# Altium schematic sheet Power.SchDoc
size 292 x 193 mm; SheetNumber: 2; SheetTotal: 3
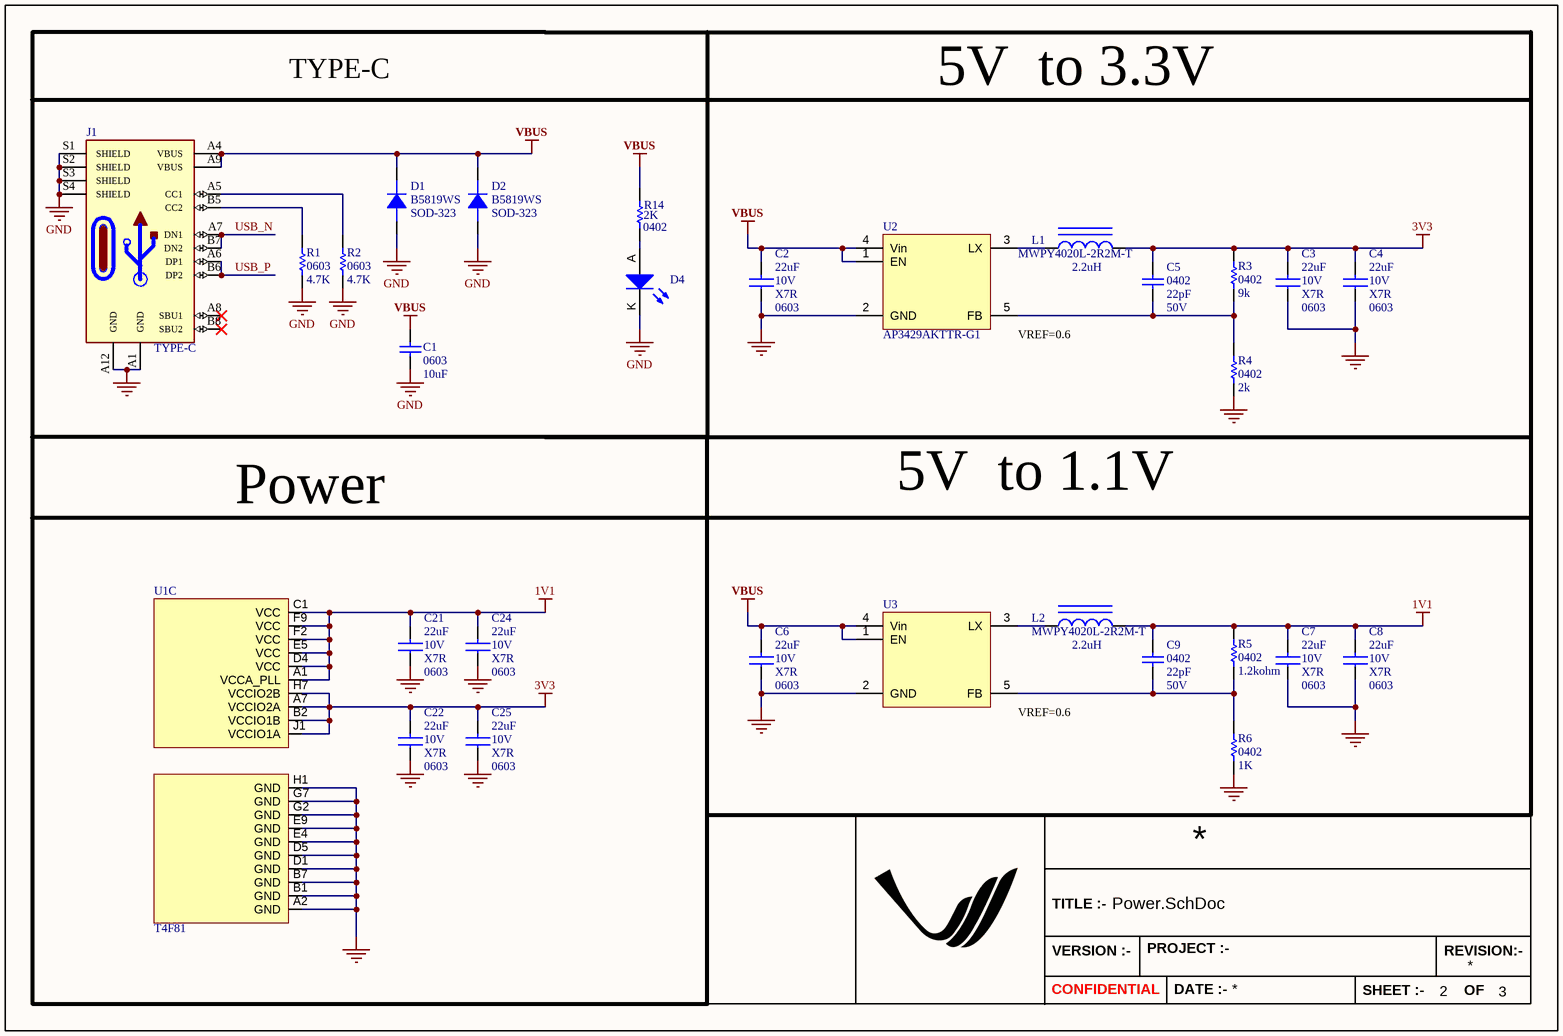
[diagram p0: Power.SchDoc]

## Parts
C1  value 10uF  Case/Package: 0603  [CAPC0603]  (hidden comment: Capacitor)
C2  value 22uF  Voltage: 10V  Dielectric: X7R  Case/Package: 0603  [CAPC0603]
C3  value 22uF  Voltage: 10V  Dielectric: X7R  Case/Package: 0603  [CAPC0603]
C4  value 22uF  Voltage: 10V  Dielectric: X7R  Case/Package: 0603  [CAPC0603]
C5  value 22pF  Case/Package: 0402  Voltage: 50V  [CAPC0402]
C6  value 22uF  Voltage: 10V  Dielectric: X7R  Case/Package: 0603  [CAPC0603]
C7  value 22uF  Voltage: 10V  Dielectric: X7R  Case/Package: 0603  [CAPC0603]
C8  value 22uF  Voltage: 10V  Dielectric: X7R  Case/Package: 0603  [CAPC0603]
C9  value 22pF  Case/Package: 0402  Voltage: 50V  [CAPC0402]
C21  value 22uF  Voltage: 10V  Dielectric: X7R  Case/Package: 0603  [CAPC0603]
C22  value 22uF  Voltage: 10V  Dielectric: X7R  Case/Package: 0603  [CAPC0603]
C24  value 22uF  Voltage: 10V  Dielectric: X7R  Case/Package: 0603  [CAPC0603]
C25  value 22uF  Voltage: 10V  Dielectric: X7R  Case/Package: 0603  [CAPC0603]
D1  Manufacturer Part Number: B5819WS  [SOD-323]  (hidden comment: DIODE_B5819WS)
D2  Manufacturer Part Number: B5819WS  [SOD-323]  (hidden comment: DIODE_B5819WS)
D4  (no value)  [led_0603]
J1  TYPE-C  [TYPE-C]
L1  value 2.2uH  Manufacturer Part Number: MWPY4020L-2R2M-T  [IND_4.0X4.0X2.0]  (hidden comment: IND_1)
L2  value 2.2uH  Manufacturer Part Number: MWPY4020L-2R2M-T  [IND_4.0X4.0X2.0]  (hidden comment: IND_1)
R1  value 4.7K  Case/Package: 0603  [RESC0603]  (hidden comment: Resistor)
R2  value 4.7K  Case/Package: 0603  [RESC0603]  (hidden comment: Resistor)
R3  value 9k  Case/Package: 0402  [resc0402]  (hidden comment: Res1)
R4  value 2k  Case/Package: 0402  [resc0402]  (hidden comment: Res1)
R5  value 1.2kohm  Case/Package: 0402  [resc0402]  (hidden comment: Res1)
R6  value 1K  Case/Package: 0402  [resc0402]  (hidden comment: Res1)
R14  value 2K  Case/Package: 0402  [resc0402]  (hidden comment: Res1)
U1  T4F81  [T4F81 fpga]  (part C of 3)
U2  Manufacturer Part Number: AP3429AKTTR-G1  [SOT23-5]  (hidden comment: AP3429)
U3  AP3429  [SOT23-5]  (value not drawn)

## Nets
1V1: C7.2 C8.2 C9.2 C21.2 C24.2 L2.2 R5.1 U1.A1(VCCA_PLL) U1.C1(VCC) U1.D4(VCC) U1.E5(VCC) U1.F2(VCC) U1.F9(VCC)
3V3: C3.2 C4.2 C5.2 C22.2 C25.2 L1.2 R3.1 U1.A7(VCCIO2A) U1.B2(VCCIO1B) U1.H7(VCCIO2B) U1.J1(VCCIO1A)
GND: C1.2 C2.1 C3.1 C4.1 C6.1 C7.1 C8.1 C21.1 C22.1 C24.1 C25.1 D1.1(A) D2.1(A) D4.K J1.A1(GND) J1.A12(GND) J1.S1(SHIELD) J1.S2(SHIELD) J1.S3(SHIELD) J1.S4(SHIELD) R1.1 R2.1 R4.2 R6.2 U1.A2(GND) U1.B1(GND) U1.B7(GND) U1.D1(GND) U1.D5(GND) U1.E4(GND) U1.E9(GND) U1.G2(GND) U1.G7(GND) U1.H1(GND) U2.2(GND) U3.2(GND)
VBUS: C1.1 C2.2 C6.2 D1.2(K) D2.2(K) J1.A4(VBUS) J1.A9(VBUS) R14.1 U2.1(EN) U2.4(Vin) U3.1(EN) U3.4(Vin)
USB_N: J1.A7(DN1) J1.B7(DN2)
USB_P: J1.A6(DP1) J1.B6(DP2)
NetC5_1: C5.1 R3.2 R4.1 U2.5(FB)
NetC9_1: C9.1 R5.2 R6.1 U3.5(FB)
NetD4_A: D4.A R14.2
NetJ1_A5: J1.A5(CC1) R2.2
NetJ1_B5: J1.B5(CC2) R1.2
NetL1_1: L1.1 U2.3(LX)
NetL2_1: L2.1 U3.3(LX)

Not connected (* = marked no-connect by the designer): J1 A8(SBU1)* B8(SBU2)*

## Notes on the sheet
- TYPE-C
- 5V  to 3.3V
- (near U2) VREF=0.6
- Power
- 5V  to 1.1V
- (near U3) VREF=0.6
- TITLE :-
- VERSION :-
- PROJECT :-
- SHEET :-
- REVISION:-
- OF
- CONFIDENTIAL
- DATE :-

## Library data of the parts
C1 = Capacitor: Ceramic Capacitor, 10uF, 0603,10V; Manufacturer Part Number: *
C2-C4 C6-C8 C21 C22 C24 C25 = Cap: CAP CER 22uF 10V X7R 0603; Manufacturer Part Number: CC0603KRX7R6BB226; Vicharak-PN: V001478; Type: Capacitor
C5 C9 = Capacitor: Ceramic Capacitor, 22pF, 0402,50V; Manufacturer Part Number: *
  C9: Vicharak-PN: *
D1 D2 = DIODE_B5819WS: Schottky Barrier£¬B5819WS SOD-323; Vicharak-PN: V000203; Case/Package: SOD-323
D4 = LED1: RED LED 0603; Manufacturer Part Number: GREEN; Case/Package: 0603
J1 = TYPE-C: Manufacturer Part Number: C167321; Case/Package: SMD; Type: TYPE -C  CONNECTOR; Vicharak-PN: *; Parameter 1: *
L1 L2 = IND_1: 2.2uH, 48mOhm, 4.35A, 6.12A, ±20%, SMD,4x4x2mm, Power Inductor (MWPY4020L-2R2M-T) (C2934996); Vicharak-PN: V001341; Package: SMD,4x4mm; Type: INDUCTOR
R1 R2 = Resistor: Thick Film Resistor -  4.7Kohm, 1%, 0603
R3 = Res1: Thick Film Resistor -  9Kohm, 1%, 0402; Vicharak-PN: V000698; Tolerance: 1%; Type: Resistor
R4 = Res1: Thick Film Resistor -  2Kohm, 1%, 0402; Vicharak-PN: V000698; Tolerance: 1%; Type: Resistor
R5 = Res1: Thick Film Resistor -  1.2kohm, 1%, 0402; Vicharak-PN: V000360; Tolerance: 1%; Type: Resistor
R6 = Res1: Thick Film Resistor -  1Kohm, 1%, 0402; Manufacturer Part Number: 0402WGF1001TCE; Vicharak-PN: V000698; Tolerance: 1%; Type: Resistor
R14 = Res1: Thick Film Resistor -  2Kohm, 1%, 0402; Manufacturer Part Number: *
U2 U3 = AP3429: Buck Switching Regulator IC Positive Adjustable 0.6V 1 Output 2A SOT-23-5 Thin, TSOT-23-5; Vicharak-PN: V001301; Package: SOT-23-5; Type: IC
U1 = T4F81: Manufacturer_Part_Number: T4F81; Case/Package: *; Vicharak-PN: *; Type: *